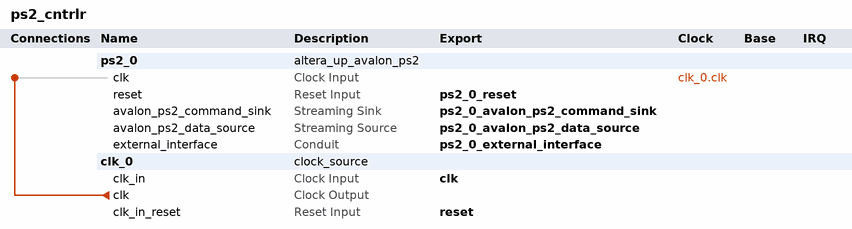
[diagram p0: system contents]
# Platform Designer (Qsys) system ps2_cntrlr, Cyclone V 5CSEMA5F31C6
# Parameters at their usual value, and those the tool derives, are not listed.
package require -exact qsys 17.0
create_system ps2_cntrlr
set_project_property DEVICE_FAMILY {Cyclone V}
set_project_property DEVICE 5CSEMA5F31C6

add_instance ps2_0 altera_up_avalon_ps2 17.0
set_instance_property ps2_0 AUTO_EXPORT true
set_instance_parameter_value ps2_0 avalon_bus_type Streaming

add_instance clk_0 clock_source 17.0
set_instance_parameter_value clk_0 clockFrequency 4212962

# connections
add_connection clk_0.clk ps2_0.clk clock

# exported interfaces
add_interface clk clock sink
set_interface_property clk EXPORT_OF clk_0.clk_in
add_interface ps2_0_avalon_ps2_command_sink avalon_streaming sink
set_interface_property ps2_0_avalon_ps2_command_sink EXPORT_OF ps2_0.avalon_ps2_command_sink
add_interface ps2_0_avalon_ps2_data_source avalon_streaming source
set_interface_property ps2_0_avalon_ps2_data_source EXPORT_OF ps2_0.avalon_ps2_data_source
add_interface ps2_0_external_interface conduit end
set_interface_property ps2_0_external_interface EXPORT_OF ps2_0.external_interface
add_interface ps2_0_reset reset sink
set_interface_property ps2_0_reset EXPORT_OF ps2_0.reset
add_interface reset reset sink
set_interface_property reset EXPORT_OF clk_0.clk_in_reset

set_interconnect_requirement {$system} qsys_mm.clockCrossingAdapter HANDSHAKE
set_interconnect_requirement {$system} qsys_mm.enableEccProtection FALSE
set_interconnect_requirement {$system} qsys_mm.insertDefaultSlave FALSE
set_interconnect_requirement {$system} qsys_mm.maxAdditionalLatency 1

save_system ps2_cntrlr.qsys
